# EasyEDA schematic ArduinoFile Schematic.json
TITLE: ProFile Interface Adapter - Arduino Mega Version; REV: 1.0; Date: 2021-08-20; Sheet: 1/1; Drawn By: AlexTheCat123; Company: N/A
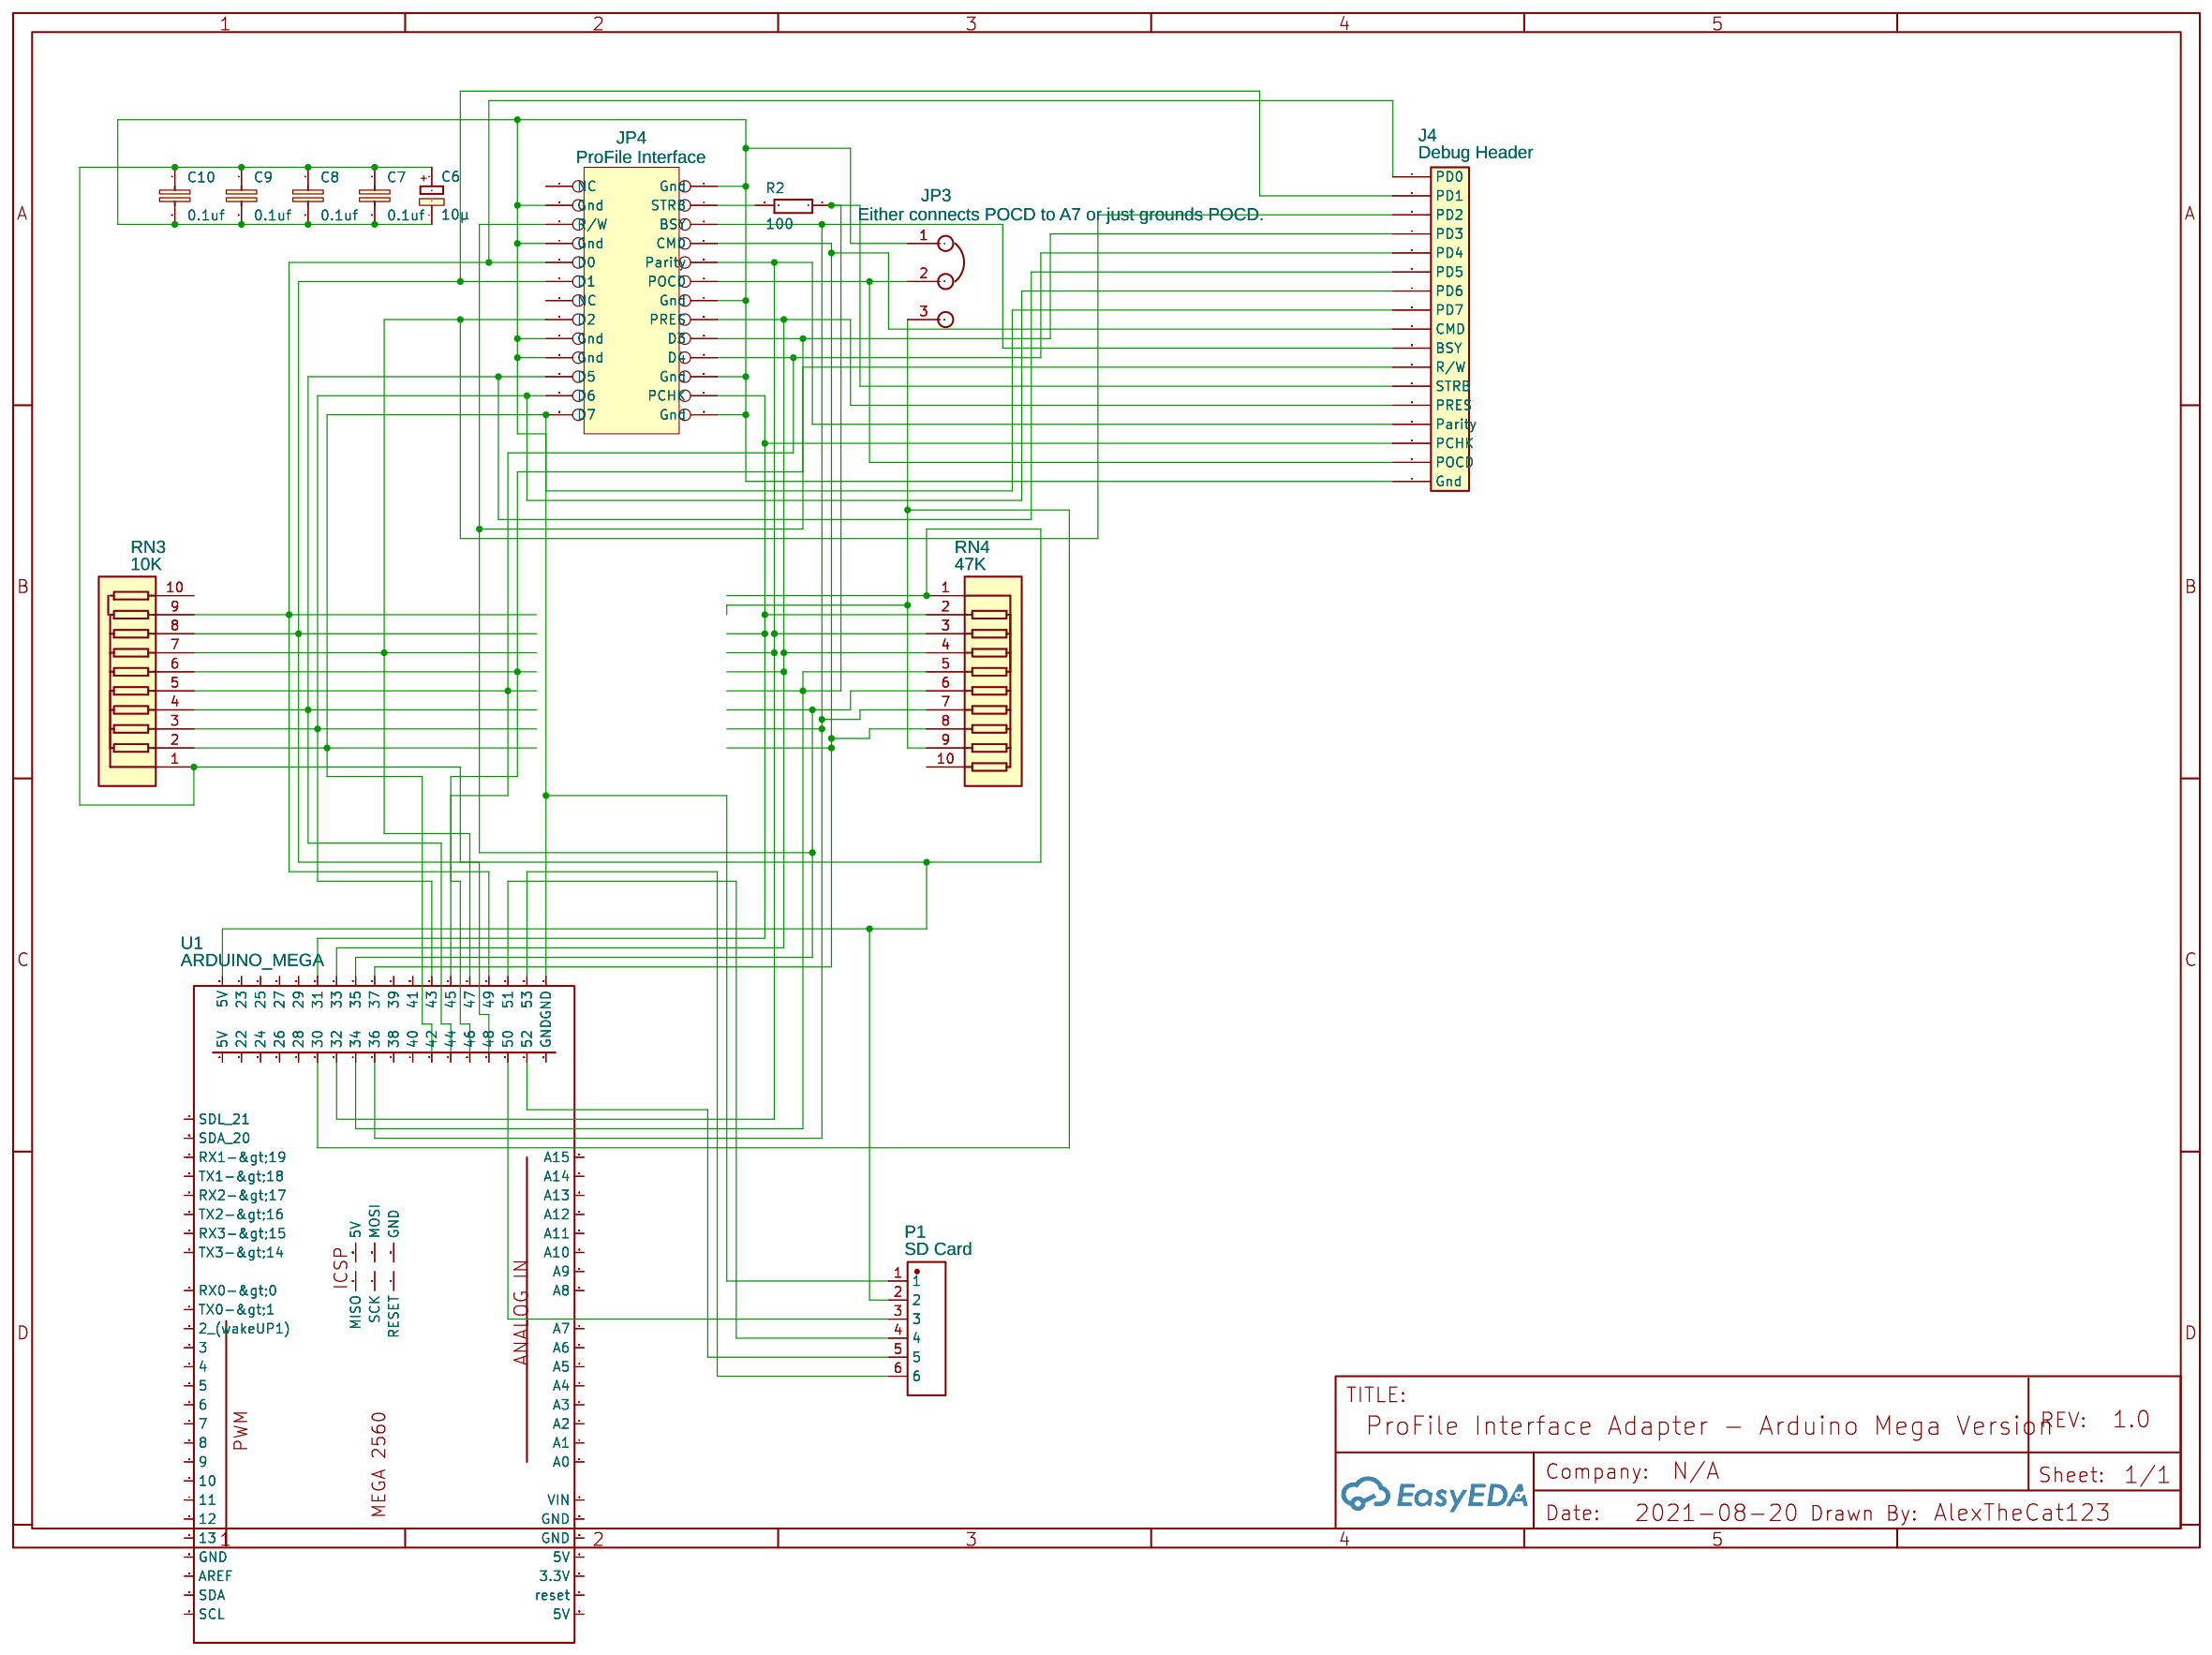
[diagram p0: schematic sheet]

## Parts
C6  10µ  [E2-5]
C7  0.1uf  [C050-025X075]
C8  0.1uf  [C050-025X075]
C9  0.1uf  [C050-025X075]
C10  0.1uf  [C050-025X075]
J4  Debug Header  [HDR-17X1/2.54]
JP3  Either connects POCD to A7 or just grounds POCD.  [1X03]
JP4  ProFile Interface  [IDC26]
P1  SD Card  [HDR-TH_6P-P2.54-V-F]
R2  100  [0204/7]
RN3  10K  [SIP-10]
RN4  47K  [SIP-10]
U1  ARDUINO_MEGA  [ARDUINO_MEGA2560]

## Library data of the parts
J4 = Header-Female-2.54_1x17: Supplier Part: C52709; Manufacturer: LCSC; Manufacturer Part: Header-2.54_1x17; Contributor: ASchoen
JP3 = JUMPER: Contributor: KiCad
JP4 = HEADER 13X2
P1 = Header-Female-2.54_1x6: Supplier: LCSC; Manufacturer: BOOMELE; Manufacturer Part: Female header 1*6p; Supplier Part: C40877; JLCPCB Part Class: Extended Part
RN3 RN4 = 1K: Tolerance: ±5%; EasyEDA: E84206; Supplier Part: E84206; Supplier: EasyEDA; Manufacturer Part: A09-202JP
U1 = ARDUINO_MEGA: Manufacturer Part: ARDUINO MEGA; Contributor: FARIAS LOZOYA CARLOSALEJANDRO

## Nets
Net-(C6-+): C6.+ C7.1 C8.1 C9.1 C10.1 P1.2 RN3.1 RN4.1 U1.5V..(5V)
Net-(C6--): C6.- C7.2 C8.2 C9.2 C10.2 J4.17(Gnd) JP3.1 JP4.2(Gnd) JP4.3(Gnd) JP4.7(Gnd) JP4.14(Gnd) JP4.17(Gnd) JP4.19(Gnd) JP4.22(Gnd) JP4.26(Gnd) P1.1 U1.GND
Net-(J4-1): J4.1(PD0) JP4.9(D0) RN3.9 U1.56(49)
Net-(J4-2): J4.2(PD1) JP4.11(D1) RN3.8 U1.55(48)
Net-(J4-3): J4.3(PD2) JP4.15(D2) RN3.7 U1.54(47)
Net-(J4-4): J4.4(PD3) JP4.18(D3) RN3.6 U1.53(46)
Net-(J4-5): J4.5(PD4) JP4.20(D4) RN3.5 U1.52(45)
Net-(J4-6): J4.6(PD5) JP4.21(D5) RN3.4 U1.51(44)
Net-(J4-7): J4.7(PD6) JP4.23(D6) RN3.3 U1.50(43)
Net-(J4-8): J4.8(PD7) JP4.25(D7) RN3.2
Net-(J4-9): J4.9(CMD) JP4.8(CMD) RN4.8 U1.44(37)
Net-(J4-10): J4.10(BSY) JP4.6(BSY) RN4.7 U1.43(36)
Net-(J4-11): J4.11(R/W) JP4.5(R/W) RN4.6 U1.42(35)
Net-(J4-12): J4.12(STRB) R2.2 RN4.5 U1.41(34)
Net-(J4-13): J4.13(PRES) JP4.16(PRES) RN4.4 U1.40(33)
Net-(J4-14): J4.14(Parity) JP4.10(Parity) RN4.3 U1.39(32)
Net-(J4-15): J4.15(PCHK) JP4.24(PCHK) RN4.2 U1.38(31)
Net-(J4-16): J4.16(POCD) JP3.2 JP4.12(POCD)
Net-(JP3-3): JP3.3(2) RN4.9 U1.37(30)
Net-(JP4-4): JP4.4(STRB) R2.1
Net-(P1-3): P1.3 U1.57(50)
Net-(P1-4): P1.4 U1.58(51)
Net-(P1-5): P1.5 U1.59(52)
Net-(P1-6): P1.6 U1.60(53)

Not connected (* = marked no-connect by the designer): JP4 1(NC) 13(NC); RN3 10(9); RN4 10(9); U1 3(AREF) 5(13) 5V 5V.(5V) 5V...(5V) 5VICSP(5V) 6(12) 7(11) 8(10) 9 10(8) 11(7) 12(6) 13(5) 14(4) 15(3) 16(2 (wakeUP1)) 17(TX0->1) 18(RX0->0) 19(TX3->14) 20(RX3->15) 21(TX2->16) 22(RX2->17) 23(TX1->18) 24(RX1->19) 29(22) 30(23) 31(24) 32(25) 33(26) 34(27) 35(28) 36(29) 45(38) 46(39) 47(40) 48(41) 49(42) 63(A15) 64(A14) 65(A13) 66(A12) 67(A11) 68(A10) 69(A9) 70(A8) 71(A7) 72(A6) 73(A5) 74(A4) 75(A3) 76(A2) 77(A1) 78(A0) 83(3.3V) 84(reset) 86(MISO) 87(SCK) 88(RESET) 90(MOSI) SCL SCL2(SDL 21) SDA SDA2(SDA 20) VIN
